# EAGLE schematic Light Table Board (EAGLE 7.1.0)
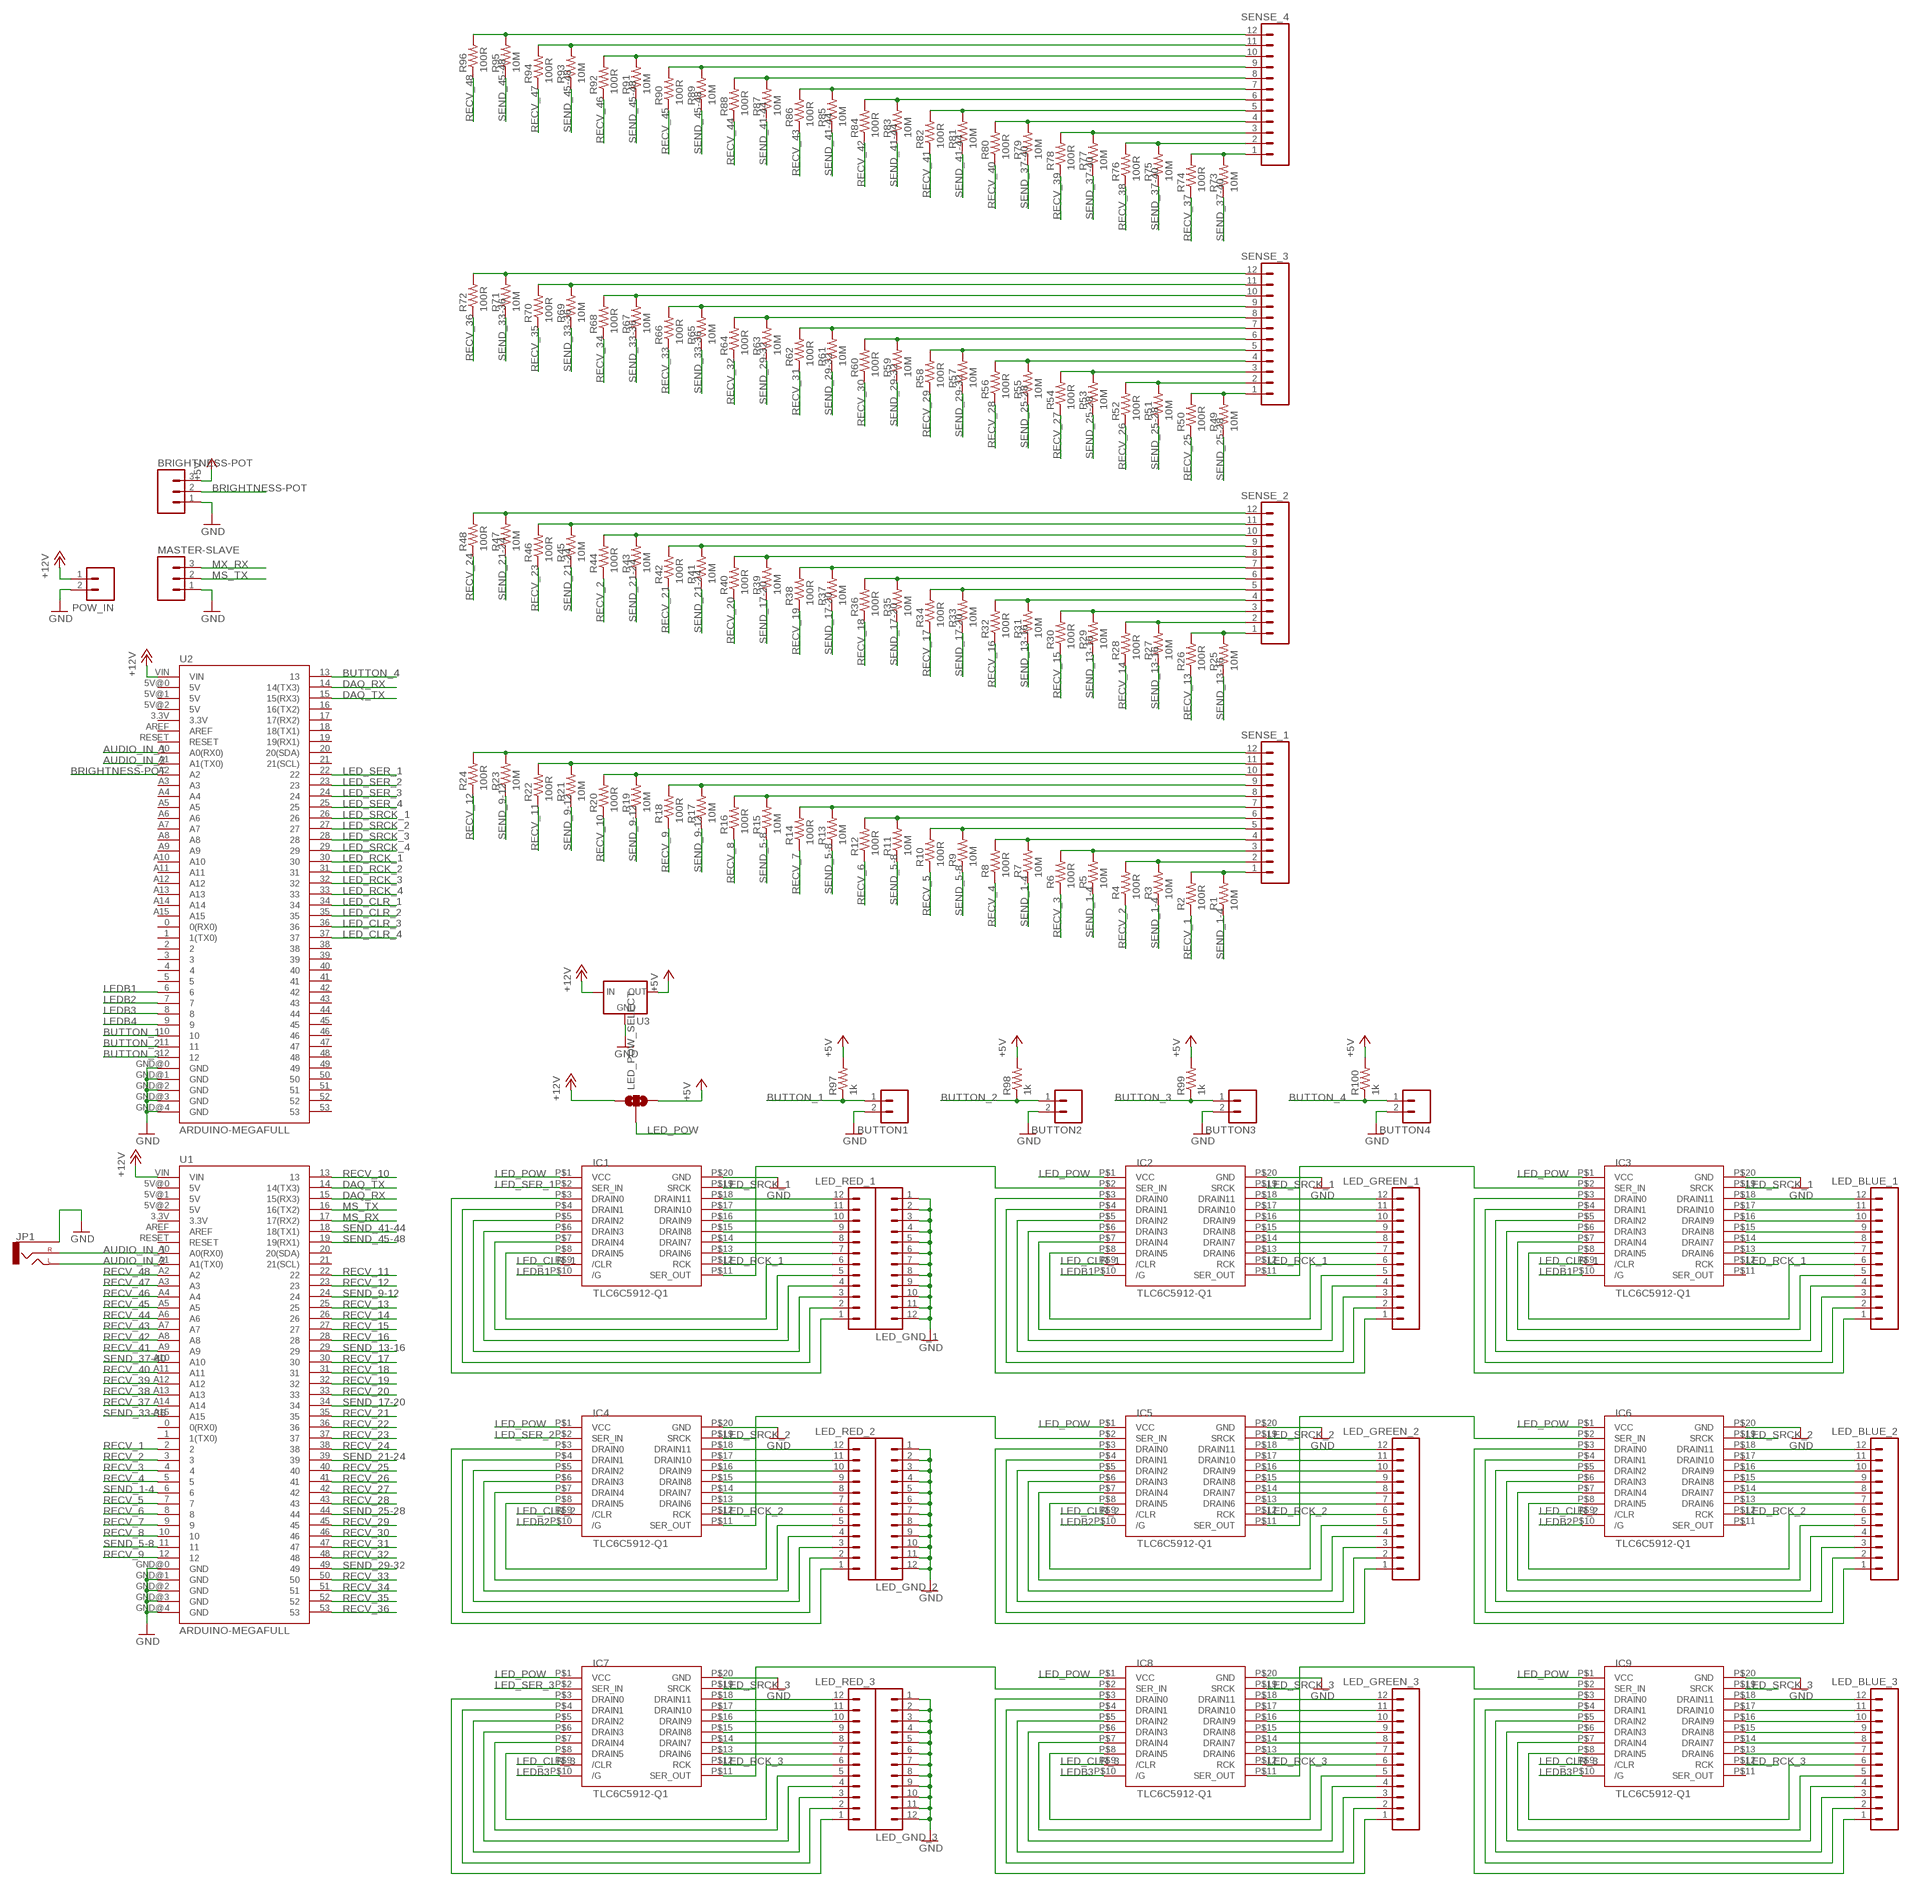
[diagram p0: schematic, sheet 1, part 1 of 2]
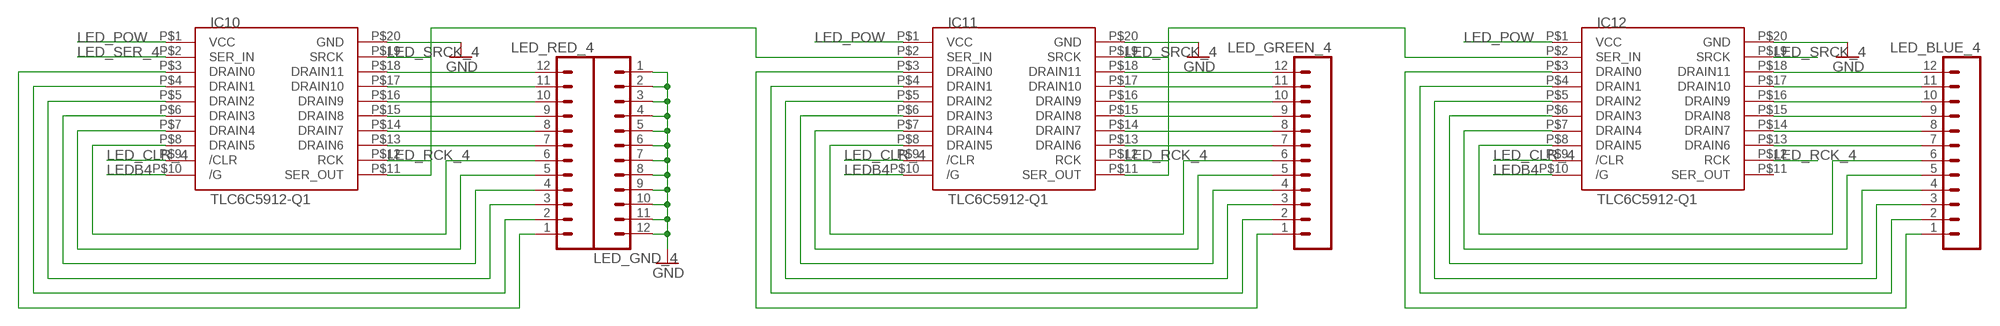
[diagram p1: schematic, sheet 1, part 2 of 2]

## Parts
BRIGHTNESS-POT  M03SCREW  [SCREWTERMINAL-3.5MM-3]
BUTTON1  M023.5MM-NO_SILK  [SCREWTERMINAL-3.5MM-2-NS]
BUTTON2  M023.5MM-NO_SILK  [SCREWTERMINAL-3.5MM-2-NS]
BUTTON3  M023.5MM-NO_SILK  [SCREWTERMINAL-3.5MM-2-NS]
BUTTON4  M023.5MM-NO_SILK  [SCREWTERMINAL-3.5MM-2-NS]
IC1  TLC6C5912-Q1  [SOIC-20]
IC2  TLC6C5912-Q1  [SOIC-20]
IC3  TLC6C5912-Q1  [SOIC-20]
IC4  TLC6C5912-Q1  [SOIC-20]
IC5  TLC6C5912-Q1  [SOIC-20]
IC6  TLC6C5912-Q1  [SOIC-20]
IC7  TLC6C5912-Q1  [SOIC-20]
IC8  TLC6C5912-Q1  [SOIC-20]
IC9  TLC6C5912-Q1  [SOIC-20]
IC10  TLC6C5912-Q1  [SOIC-20]
IC11  TLC6C5912-Q1  [SOIC-20]
IC12  TLC6C5912-Q1  [SOIC-20]
JP1  AUDIO-JACK2.5MM  [STEREOJACK2.5MM_STEREOJACK2.5MM]
LED_BLUE_1  M12LONGPADS  [1X12_LONGPADS]
LED_BLUE_2  M12LONGPADS  [1X12_LONGPADS]
LED_BLUE_3  M12LONGPADS  [1X12_LONGPADS]
LED_BLUE_4  M12LONGPADS  [1X12_LONGPADS]
LED_GND_1  M12LONGPADS  [1X12_LONGPADS]
LED_GND_2  M12LONGPADS  [1X12_LONGPADS]
LED_GND_3  M12LONGPADS  [1X12_LONGPADS]
LED_GND_4  M12LONGPADS  [1X12_LONGPADS]
LED_GREEN_1  M12LONGPADS  [1X12_LONGPADS]
LED_GREEN_2  M12LONGPADS  [1X12_LONGPADS]
LED_GREEN_3  M12LONGPADS  [1X12_LONGPADS]
LED_GREEN_4  M12LONGPADS  [1X12_LONGPADS]
LED_POW_SELECT  SOLDERJUMPER_2WAYS  [SJ_3]
LED_RED_1  M12LONGPADS  [1X12_LONGPADS]
LED_RED_2  M12LONGPADS  [1X12_LONGPADS]
LED_RED_3  M12LONGPADS  [1X12_LONGPADS]
LED_RED_4  M12LONGPADS  [1X12_LONGPADS]
MASTER-SLAVE  M03SCREW  [SCREWTERMINAL-3.5MM-3]
POW_IN  M023.5MM-NO_SILK  [SCREWTERMINAL-3.5MM-2-NS]
R1  10M  R-US_R1206  [R1206]
R2  100R  R-US_R1206  [R1206]
R3  10M  R-US_R1206  [R1206]
R4  100R  R-US_R1206  [R1206]
R5  10M  R-US_R1206  [R1206]
R6  100R  R-US_R1206  [R1206]
R7  10M  R-US_R1206  [R1206]
R8  100R  R-US_R1206  [R1206]
R9  10M  R-US_R1206  [R1206]
R10  100R  R-US_R1206  [R1206]
R11  10M  R-US_R1206  [R1206]
R12  100R  R-US_R1206  [R1206]
R13  10M  R-US_R1206  [R1206]
R14  100R  R-US_R1206  [R1206]
R15  10M  R-US_R1206  [R1206]
R16  100R  R-US_R1206  [R1206]
R17  10M  R-US_R1206  [R1206]
R18  100R  R-US_R1206  [R1206]
R19  10M  R-US_R1206  [R1206]
R20  100R  R-US_R1206  [R1206]
R21  10M  R-US_R1206  [R1206]
R22  100R  R-US_R1206  [R1206]
R23  10M  R-US_R1206  [R1206]
R24  100R  R-US_R1206  [R1206]
R25  10M  R-US_R1206  [R1206]
R26  100R  R-US_R1206  [R1206]
R27  10M  R-US_R1206  [R1206]
R28  100R  R-US_R1206  [R1206]
R29  10M  R-US_R1206  [R1206]
R30  100R  R-US_R1206  [R1206]
R31  10M  R-US_R1206  [R1206]
R32  100R  R-US_R1206  [R1206]
R33  10M  R-US_R1206  [R1206]
R34  100R  R-US_R1206  [R1206]
R35  10M  R-US_R1206  [R1206]
R36  100R  R-US_R1206  [R1206]
R37  10M  R-US_R1206  [R1206]
R38  100R  R-US_R1206  [R1206]
R39  10M  R-US_R1206  [R1206]
R40  100R  R-US_R1206  [R1206]
R41  10M  R-US_R1206  [R1206]
R42  100R  R-US_R1206  [R1206]
R43  10M  R-US_R1206  [R1206]
R44  100R  R-US_R1206  [R1206]
R45  10M  R-US_R1206  [R1206]
R46  100R  R-US_R1206  [R1206]
R47  10M  R-US_R1206  [R1206]
R48  100R  R-US_R1206  [R1206]
R49  10M  R-US_R1206  [R1206]
R50  100R  R-US_R1206  [R1206]
R51  10M  R-US_R1206  [R1206]
R52  100R  R-US_R1206  [R1206]
R53  10M  R-US_R1206  [R1206]
R54  100R  R-US_R1206  [R1206]
R55  10M  R-US_R1206  [R1206]
R56  100R  R-US_R1206  [R1206]
R57  10M  R-US_R1206  [R1206]
R58  100R  R-US_R1206  [R1206]
R59  10M  R-US_R1206  [R1206]
R60  100R  R-US_R1206  [R1206]
R61  10M  R-US_R1206  [R1206]
R62  100R  R-US_R1206  [R1206]
R63  10M  R-US_R1206  [R1206]
R64  100R  R-US_R1206  [R1206]
R65  10M  R-US_R1206  [R1206]
R66  100R  R-US_R1206  [R1206]
R67  10M  R-US_R1206  [R1206]
R68  100R  R-US_R1206  [R1206]
R69  10M  R-US_R1206  [R1206]
R70  100R  R-US_R1206  [R1206]
R71  10M  R-US_R1206  [R1206]
R72  100R  R-US_R1206  [R1206]
R73  10M  R-US_R1206  [R1206]
R74  100R  R-US_R1206  [R1206]
R75  10M  R-US_R1206  [R1206]
R76  100R  R-US_R1206  [R1206]
R77  10M  R-US_R1206  [R1206]
R78  100R  R-US_R1206  [R1206]
R79  10M  R-US_R1206  [R1206]
R80  100R  R-US_R1206  [R1206]
R81  10M  R-US_R1206  [R1206]
R82  100R  R-US_R1206  [R1206]
R83  10M  R-US_R1206  [R1206]
R84  100R  R-US_R1206  [R1206]
R85  10M  R-US_R1206  [R1206]
R86  100R  R-US_R1206  [R1206]
R87  10M  R-US_R1206  [R1206]
R88  100R  R-US_R1206  [R1206]
R89  10M  R-US_R1206  [R1206]
R90  100R  R-US_R1206  [R1206]
R91  10M  R-US_R1206  [R1206]
R92  100R  R-US_R1206  [R1206]
R93  10M  R-US_R1206  [R1206]
R94  100R  R-US_R1206  [R1206]
R95  10M  R-US_R1206  [R1206]
R96  100R  R-US_R1206  [R1206]
R97  1k  R-US_R1206  [R1206]
R98  1k  R-US_R1206  [R1206]
R99  1k  R-US_R1206  [R1206]
R100  1k  R-US_R1206  [R1206]
SENSE_1  M12LONGPADS  [1X12_LONGPADS]
SENSE_2  M12LONGPADS  [1X12_LONGPADS]
SENSE_3  M12LONGPADS  [1X12_LONGPADS]
SENSE_4  M12LONGPADS  [1X12_LONGPADS]
U1  ARDUINO-MEGAFULL  [ARDUINO_MEGA]
U2  ARDUINO-MEGAFULL  [ARDUINO_MEGA]
U3  V_REG_78XX-TO-220  [TO-220-ALT]

## Nets
+5V: BRIGHTNESS-POT.3 LED_POW_SELECT.3 R97.2 R98.2 R99.2 R100.2 U3.OUT
+12V: LED_POW_SELECT.1 POW_IN.1 U1.VIN U2.VIN U3.IN
AUDIO_IN_1: JP1.TIP(RIGHT) U1.A0(A0(RX0)) U2.A0(A0(RX0))
AUDIO_IN_2: JP1.SHIELD(LEFT) U1.A1(A1(TX0)) U2.A1(A1(TX0))
BRIGHTNESS-POT: BRIGHTNESS-POT.2 U2.A2
BUTTON_1: BUTTON1.1 R97.1 U2.10
BUTTON_2: BUTTON2.1 R98.1 U2.11
BUTTON_3: BUTTON3.1 R99.1 U2.12
BUTTON_4: BUTTON4.1 R100.1 U2.13
DAQ_RX: U1.15(15(RX3)) U2.14(14(TX3))
DAQ_TX: U1.14(14(TX3)) U2.15(15(RX3))
GND: BRIGHTNESS-POT.1 BUTTON1.2 BUTTON2.2 BUTTON3.2 BUTTON4.2 IC1.P$20(GND) IC2.P$20(GND) IC3.P$20(GND) IC4.P$20(GND) IC5.P$20(GND) IC6.P$20(GND) IC7.P$20(GND) IC8.P$20(GND) IC9.P$20(GND) IC10.P$20(GND) IC11.P$20(GND) IC12.P$20(GND) JP1.RING1(SLEEVE) LED_GND_1.1 LED_GND_1.2 LED_GND_1.3 LED_GND_1.4 LED_GND_1.5 LED_GND_1.6 LED_GND_1.7 LED_GND_1.8 LED_GND_1.9 LED_GND_1.10 LED_GND_1.11 LED_GND_1.12 LED_GND_2.1 LED_GND_2.2 LED_GND_2.3 LED_GND_2.4 LED_GND_2.5 LED_GND_2.6 LED_GND_2.7 LED_GND_2.8 LED_GND_2.9 LED_GND_2.10 LED_GND_2.11 LED_GND_2.12 LED_GND_3.1 LED_GND_3.2 LED_GND_3.3 LED_GND_3.4 LED_GND_3.5 LED_GND_3.6 LED_GND_3.7 LED_GND_3.8 LED_GND_3.9 LED_GND_3.10 LED_GND_3.11 LED_GND_3.12 LED_GND_4.1 LED_GND_4.2 LED_GND_4.3 LED_GND_4.4 LED_GND_4.5 LED_GND_4.6 LED_GND_4.7 LED_GND_4.8 LED_GND_4.9 LED_GND_4.10 LED_GND_4.11 LED_GND_4.12 MASTER-SLAVE.1 POW_IN.2 U1.GND@0(GND) U1.GND@1(GND) U1.GND@2(GND) U1.GND@3(GND) U1.GND@4(GND) U2.GND@0(GND) U2.GND@1(GND) U2.GND@2(GND) U2.GND@3(GND) U2.GND@4(GND) U3.GND
LED_CLR_1: IC1.P$9(/CLR) IC2.P$9(/CLR) IC3.P$9(/CLR) U2.34
LED_CLR_2: IC4.P$9(/CLR) IC5.P$9(/CLR) IC6.P$9(/CLR) U2.35
LED_CLR_3: IC7.P$9(/CLR) IC8.P$9(/CLR) IC9.P$9(/CLR) U2.36
LED_CLR_4: IC10.P$9(/CLR) IC11.P$9(/CLR) IC12.P$9(/CLR) U2.37
LED_POW: IC1.P$1(VCC) IC2.P$1(VCC) IC3.P$1(VCC) IC4.P$1(VCC) IC5.P$1(VCC) IC6.P$1(VCC) IC7.P$1(VCC) IC8.P$1(VCC) IC9.P$1(VCC) IC10.P$1(VCC) IC11.P$1(VCC) IC12.P$1(VCC) LED_POW_SELECT.2
LED_RCK_1: IC1.P$12(RCK) IC2.P$12(RCK) IC3.P$12(RCK) U2.30
LED_RCK_2: IC4.P$12(RCK) IC5.P$12(RCK) IC6.P$12(RCK) U2.31
LED_RCK_3: IC7.P$12(RCK) IC8.P$12(RCK) IC9.P$12(RCK) U2.32
LED_RCK_4: IC10.P$12(RCK) IC11.P$12(RCK) IC12.P$12(RCK) U2.33
LED_SER_1: IC1.P$2(SER_IN) U2.22
LED_SER_2: IC4.P$2(SER_IN) U2.23
LED_SER_3: IC7.P$2(SER_IN) U2.24
LED_SER_4: IC10.P$2(SER_IN) U2.25
LED_SRCK_1: IC1.P$19(SRCK) IC2.P$19(SRCK) IC3.P$19(SRCK) U2.26
LED_SRCK_2: IC4.P$19(SRCK) IC5.P$19(SRCK) IC6.P$19(SRCK) U2.27
LED_SRCK_3: IC7.P$19(SRCK) IC8.P$19(SRCK) IC9.P$19(SRCK) U2.28
LED_SRCK_4: IC10.P$19(SRCK) IC11.P$19(SRCK) IC12.P$19(SRCK) U2.29
LEDB1: IC1.P$10(/G) IC2.P$10(/G) IC3.P$10(/G) U2.6
LEDB2: IC4.P$10(/G) IC5.P$10(/G) IC6.P$10(/G) U2.7
LEDB3: IC7.P$10(/G) IC8.P$10(/G) IC9.P$10(/G) U2.8
LEDB4: IC10.P$10(/G) IC11.P$10(/G) IC12.P$10(/G) U2.9
MS_RX: U1.17(17(RX2))
MS_TX: MASTER-SLAVE.2 U1.16(16(TX2))
MX_RX: MASTER-SLAVE.3
N$1: IC1.P$8(DRAIN5) LED_RED_1.6
N$2: IC1.P$18(DRAIN11) LED_RED_1.12
N$3: IC1.P$17(DRAIN10) LED_RED_1.11
N$4: IC1.P$16(DRAIN9) LED_RED_1.10
N$5: IC1.P$15(DRAIN8) LED_RED_1.9
N$6: IC1.P$14(DRAIN7) LED_RED_1.8
N$7: IC1.P$13(DRAIN6) LED_RED_1.7
N$8: IC1.P$7(DRAIN4) LED_RED_1.5
N$9: IC1.P$6(DRAIN3) LED_RED_1.4
N$10: IC1.P$5(DRAIN2) LED_RED_1.3
N$11: IC1.P$4(DRAIN1) LED_RED_1.2
N$12: IC1.P$3(DRAIN0) LED_RED_1.1
N$13: IC2.P$8(DRAIN5) LED_GREEN_1.6
N$14: IC2.P$18(DRAIN11) LED_GREEN_1.12
N$15: IC2.P$17(DRAIN10) LED_GREEN_1.11
N$16: IC2.P$16(DRAIN9) LED_GREEN_1.10
N$17: IC2.P$15(DRAIN8) LED_GREEN_1.9
N$18: IC2.P$14(DRAIN7) LED_GREEN_1.8
N$19: IC2.P$13(DRAIN6) LED_GREEN_1.7
N$20: IC2.P$7(DRAIN4) LED_GREEN_1.5
N$21: IC2.P$6(DRAIN3) LED_GREEN_1.4
N$22: IC2.P$5(DRAIN2) LED_GREEN_1.3
N$23: IC2.P$4(DRAIN1) LED_GREEN_1.2
N$24: IC2.P$3(DRAIN0) LED_GREEN_1.1
N$25: IC1.P$11(SER_OUT) IC2.P$2(SER_IN)
N$26: IC3.P$8(DRAIN5) LED_BLUE_1.6
N$27: IC3.P$18(DRAIN11) LED_BLUE_1.12
N$28: IC3.P$17(DRAIN10) LED_BLUE_1.11
N$29: IC3.P$16(DRAIN9) LED_BLUE_1.10
N$30: IC3.P$15(DRAIN8) LED_BLUE_1.9
N$31: IC3.P$14(DRAIN7) LED_BLUE_1.8
N$32: IC3.P$13(DRAIN6) LED_BLUE_1.7
N$33: IC3.P$7(DRAIN4) LED_BLUE_1.5
N$34: IC3.P$6(DRAIN3) LED_BLUE_1.4
N$35: IC3.P$5(DRAIN2) LED_BLUE_1.3
N$36: IC3.P$4(DRAIN1) LED_BLUE_1.2
N$37: IC3.P$3(DRAIN0) LED_BLUE_1.1
N$38: IC2.P$11(SER_OUT) IC3.P$2(SER_IN)
N$39: R1.2 R2.2 SENSE_1.1
N$40: IC4.P$8(DRAIN5) LED_RED_2.6
N$41: IC4.P$18(DRAIN11) LED_RED_2.12
N$42: IC4.P$17(DRAIN10) LED_RED_2.11
N$43: IC4.P$16(DRAIN9) LED_RED_2.10
N$44: IC4.P$15(DRAIN8) LED_RED_2.9
N$45: IC4.P$14(DRAIN7) LED_RED_2.8
N$46: IC4.P$13(DRAIN6) LED_RED_2.7
N$47: IC4.P$7(DRAIN4) LED_RED_2.5
N$48: IC4.P$6(DRAIN3) LED_RED_2.4
N$49: IC4.P$5(DRAIN2) LED_RED_2.3
N$50: IC4.P$4(DRAIN1) LED_RED_2.2
N$51: IC4.P$3(DRAIN0) LED_RED_2.1
N$52: IC5.P$8(DRAIN5) LED_GREEN_2.6
N$53: IC5.P$18(DRAIN11) LED_GREEN_2.12
N$54: IC5.P$17(DRAIN10) LED_GREEN_2.11
N$55: IC5.P$16(DRAIN9) LED_GREEN_2.10
N$56: IC5.P$15(DRAIN8) LED_GREEN_2.9
N$57: IC5.P$14(DRAIN7) LED_GREEN_2.8
N$58: IC5.P$13(DRAIN6) LED_GREEN_2.7
N$59: IC5.P$7(DRAIN4) LED_GREEN_2.5
N$60: IC5.P$6(DRAIN3) LED_GREEN_2.4
N$61: IC5.P$5(DRAIN2) LED_GREEN_2.3
N$62: IC5.P$4(DRAIN1) LED_GREEN_2.2
N$63: IC5.P$3(DRAIN0) LED_GREEN_2.1
N$64: IC4.P$11(SER_OUT) IC5.P$2(SER_IN)
N$65: IC6.P$8(DRAIN5) LED_BLUE_2.6
N$66: IC6.P$18(DRAIN11) LED_BLUE_2.12
N$67: IC6.P$17(DRAIN10) LED_BLUE_2.11
N$68: IC6.P$16(DRAIN9) LED_BLUE_2.10
N$69: IC6.P$15(DRAIN8) LED_BLUE_2.9
N$70: IC6.P$14(DRAIN7) LED_BLUE_2.8
N$71: IC6.P$13(DRAIN6) LED_BLUE_2.7
N$72: IC6.P$7(DRAIN4) LED_BLUE_2.5
N$73: IC6.P$6(DRAIN3) LED_BLUE_2.4
N$74: IC6.P$5(DRAIN2) LED_BLUE_2.3
N$75: IC6.P$4(DRAIN1) LED_BLUE_2.2
N$76: IC6.P$3(DRAIN0) LED_BLUE_2.1
N$77: IC5.P$11(SER_OUT) IC6.P$2(SER_IN)
N$78: IC7.P$8(DRAIN5) LED_RED_3.6
N$79: IC7.P$18(DRAIN11) LED_RED_3.12
N$80: IC7.P$17(DRAIN10) LED_RED_3.11
N$81: IC7.P$16(DRAIN9) LED_RED_3.10
N$82: IC7.P$15(DRAIN8) LED_RED_3.9
N$83: IC7.P$14(DRAIN7) LED_RED_3.8
N$84: IC7.P$13(DRAIN6) LED_RED_3.7
N$85: IC7.P$7(DRAIN4) LED_RED_3.5
N$86: IC7.P$6(DRAIN3) LED_RED_3.4
N$87: IC7.P$5(DRAIN2) LED_RED_3.3
N$88: IC7.P$4(DRAIN1) LED_RED_3.2
N$89: IC7.P$3(DRAIN0) LED_RED_3.1
N$90: IC8.P$8(DRAIN5) LED_GREEN_3.6
N$91: IC8.P$18(DRAIN11) LED_GREEN_3.12
N$92: IC8.P$17(DRAIN10) LED_GREEN_3.11
N$93: IC8.P$16(DRAIN9) LED_GREEN_3.10
N$94: IC8.P$15(DRAIN8) LED_GREEN_3.9
N$95: IC8.P$14(DRAIN7) LED_GREEN_3.8
N$96: IC8.P$13(DRAIN6) LED_GREEN_3.7
N$97: IC8.P$7(DRAIN4) LED_GREEN_3.5
N$98: IC8.P$6(DRAIN3) LED_GREEN_3.4
N$99: IC8.P$5(DRAIN2) LED_GREEN_3.3
N$100: IC8.P$4(DRAIN1) LED_GREEN_3.2
N$101: IC8.P$3(DRAIN0) LED_GREEN_3.1
N$102: IC7.P$11(SER_OUT) IC8.P$2(SER_IN)
N$103: IC9.P$8(DRAIN5) LED_BLUE_3.6
N$104: IC9.P$18(DRAIN11) LED_BLUE_3.12
N$105: IC9.P$17(DRAIN10) LED_BLUE_3.11
N$106: IC9.P$16(DRAIN9) LED_BLUE_3.10
N$107: IC9.P$15(DRAIN8) LED_BLUE_3.9
N$108: IC9.P$14(DRAIN7) LED_BLUE_3.8
N$109: IC9.P$13(DRAIN6) LED_BLUE_3.7
N$110: IC9.P$7(DRAIN4) LED_BLUE_3.5
N$111: IC9.P$6(DRAIN3) LED_BLUE_3.4
N$112: IC9.P$5(DRAIN2) LED_BLUE_3.3
N$113: IC9.P$4(DRAIN1) LED_BLUE_3.2
N$114: IC9.P$3(DRAIN0) LED_BLUE_3.1
N$115: IC8.P$11(SER_OUT) IC9.P$2(SER_IN)
N$116: IC10.P$8(DRAIN5) LED_RED_4.6
N$117: IC10.P$18(DRAIN11) LED_RED_4.12
N$118: IC10.P$17(DRAIN10) LED_RED_4.11
N$119: IC10.P$16(DRAIN9) LED_RED_4.10
N$120: IC10.P$15(DRAIN8) LED_RED_4.9
N$121: IC10.P$14(DRAIN7) LED_RED_4.8
N$122: IC10.P$13(DRAIN6) LED_RED_4.7
N$123: IC10.P$7(DRAIN4) LED_RED_4.5
N$124: IC10.P$6(DRAIN3) LED_RED_4.4
N$125: IC10.P$5(DRAIN2) LED_RED_4.3
N$126: IC10.P$4(DRAIN1) LED_RED_4.2
N$127: IC10.P$3(DRAIN0) LED_RED_4.1
N$128: IC11.P$8(DRAIN5) LED_GREEN_4.6
N$129: IC11.P$18(DRAIN11) LED_GREEN_4.12
N$130: IC11.P$17(DRAIN10) LED_GREEN_4.11
N$131: IC11.P$16(DRAIN9) LED_GREEN_4.10
N$132: IC11.P$15(DRAIN8) LED_GREEN_4.9
N$133: IC11.P$14(DRAIN7) LED_GREEN_4.8
N$134: IC11.P$13(DRAIN6) LED_GREEN_4.7
N$135: IC11.P$7(DRAIN4) LED_GREEN_4.5
N$136: IC11.P$6(DRAIN3) LED_GREEN_4.4
N$137: IC11.P$5(DRAIN2) LED_GREEN_4.3
N$138: IC11.P$4(DRAIN1) LED_GREEN_4.2
N$139: IC11.P$3(DRAIN0) LED_GREEN_4.1
N$140: IC10.P$11(SER_OUT) IC11.P$2(SER_IN)
N$141: IC12.P$8(DRAIN5) LED_BLUE_4.6
N$142: IC12.P$18(DRAIN11) LED_BLUE_4.12
N$143: IC12.P$17(DRAIN10) LED_BLUE_4.11
N$144: IC12.P$16(DRAIN9) LED_BLUE_4.10
N$145: IC12.P$15(DRAIN8) LED_BLUE_4.9
N$146: IC12.P$14(DRAIN7) LED_BLUE_4.8
N$147: IC12.P$13(DRAIN6) LED_BLUE_4.7
N$148: IC12.P$7(DRAIN4) LED_BLUE_4.5
N$149: IC12.P$6(DRAIN3) LED_BLUE_4.4
N$150: IC12.P$5(DRAIN2) LED_BLUE_4.3
N$151: IC12.P$4(DRAIN1) LED_BLUE_4.2
N$152: IC12.P$3(DRAIN0) LED_BLUE_4.1
N$153: IC11.P$11(SER_OUT) IC12.P$2(SER_IN)
N$154: R3.2 R4.2 SENSE_1.2
N$155: R5.2 R6.2 SENSE_1.3
N$156: R7.2 R8.2 SENSE_1.4
N$157: R9.2 R10.2 SENSE_1.5
N$158: R11.2 R12.2 SENSE_1.6
N$159: R13.2 R14.2 SENSE_1.7
N$160: R15.2 R16.2 SENSE_1.8
N$161: R17.2 R18.2 SENSE_1.9
N$162: R19.2 R20.2 SENSE_1.10
N$163: R21.2 R22.2 SENSE_1.11
N$164: R23.2 R24.2 SENSE_1.12
N$165: R25.2 R26.2 SENSE_2.1
N$166: R27.2 R28.2 SENSE_2.2
N$167: R29.2 R30.2 SENSE_2.3
N$168: R31.2 R32.2 SENSE_2.4
N$169: R33.2 R34.2 SENSE_2.5
N$170: R35.2 R36.2 SENSE_2.6
N$171: R37.2 R38.2 SENSE_2.7
N$172: R39.2 R40.2 SENSE_2.8
N$173: R41.2 R42.2 SENSE_2.9
N$174: R43.2 R44.2 SENSE_2.10
N$175: R45.2 R46.2 SENSE_2.11
N$176: R47.2 R48.2 SENSE_2.12
N$177: R49.2 R50.2 SENSE_3.1
N$178: R51.2 R52.2 SENSE_3.2
N$179: R53.2 R54.2 SENSE_3.3
N$180: R55.2 R56.2 SENSE_3.4
N$181: R57.2 R58.2 SENSE_3.5
N$182: R59.2 R60.2 SENSE_3.6
N$183: R61.2 R62.2 SENSE_3.7
N$184: R63.2 R64.2 SENSE_3.8
N$185: R65.2 R66.2 SENSE_3.9
N$186: R67.2 R68.2 SENSE_3.10
N$187: R69.2 R70.2 SENSE_3.11
N$188: R71.2 R72.2 SENSE_3.12
N$189: R73.2 R74.2 SENSE_4.1
N$190: R75.2 R76.2 SENSE_4.2
N$191: R77.2 R78.2 SENSE_4.3
N$192: R79.2 R80.2 SENSE_4.4
N$193: R81.2 R82.2 SENSE_4.5
N$194: R83.2 R84.2 SENSE_4.6
N$195: R85.2 R86.2 SENSE_4.7
N$196: R87.2 R88.2 SENSE_4.8
N$197: R89.2 R90.2 SENSE_4.9
N$198: R91.2 R92.2 SENSE_4.10
N$199: R93.2 R94.2 SENSE_4.11
N$200: R95.2 R96.2 SENSE_4.12
RECV_1: R2.1 U1.2
RECV_2: R4.1 R44.1 U1.3
RECV_3: R6.1 U1.4
RECV_4: R8.1 U1.5
RECV_5: R10.1 U1.7
RECV_6: R12.1 U1.8
RECV_7: R14.1 U1.9
RECV_8: R16.1 U1.10
RECV_9: R18.1 U1.12
RECV_10: R20.1 U1.13
RECV_11: R22.1 U1.22
RECV_12: R24.1 U1.23
RECV_13: R26.1 U1.25
RECV_14: R28.1 U1.26
RECV_15: R30.1 U1.27
RECV_16: R32.1 U1.28
RECV_17: R34.1 U1.30
RECV_18: R36.1 U1.31
RECV_19: R38.1 U1.32
RECV_20: R40.1 U1.33
RECV_21: R42.1 U1.35
RECV_22: U1.36
RECV_23: R46.1 U1.37
RECV_24: R48.1 U1.38
RECV_25: R50.1 U1.40
RECV_26: R52.1 U1.41
RECV_27: R54.1 U1.42
RECV_28: R56.1 U1.43
RECV_29: R58.1 U1.45
RECV_30: R60.1 U1.46
RECV_31: R62.1 U1.47
RECV_32: R64.1 U1.48
RECV_33: R66.1 U1.50
RECV_34: R68.1 U1.51
RECV_35: R70.1 U1.52
RECV_36: R72.1 U1.53
RECV_37: R74.1 U1.A14
RECV_38: R76.1 U1.A13
RECV_39: R78.1 U1.A12
RECV_40: R80.1 U1.A11
RECV_41: R82.1 U1.A9
RECV_42: R84.1 U1.A8
RECV_43: R86.1 U1.A7
RECV_44: R88.1 U1.A6
RECV_45: R90.1 U1.A5
RECV_46: R92.1 U1.A4
RECV_47: R94.1 U1.A3
RECV_48: R96.1 U1.A2
SEND_1-4: R1.1 R3.1 R5.1 R7.1 U1.6
SEND_5-8: R9.1 R11.1 R13.1 R15.1 U1.11
SEND_9-12: R17.1 R19.1 R21.1 R23.1 U1.24
SEND_13-16: R25.1 R27.1 R29.1 R31.1 U1.29
SEND_17-20: R33.1 R35.1 R37.1 R39.1 U1.34
SEND_21-24: R41.1 R43.1 R45.1 R47.1 U1.39
SEND_25-28: R49.1 R51.1 R53.1 R55.1 U1.44
SEND_29-32: R57.1 R59.1 R61.1 R63.1 U1.49
SEND_33-36: R65.1 R67.1 R69.1 R71.1 U1.A15
SEND_37-40: R73.1 R75.1 R77.1 R79.1 U1.A10
SEND_41-44: R81.1 R83.1 R85.1 R87.1 U1.18(18(TX1))
SEND_45-48: R89.1 R91.1 R93.1 R95.1 U1.19(19(RX1))
Unconnected: IC3.P$11(SER_OUT) IC6.P$11(SER_OUT) IC9.P$11(SER_OUT) IC12.P$11(SER_OUT) U1.0(0(RX0)) U1.1(1(TX0)) U1.3.3V U1.5V@0(5V) U1.5V@1(5V) U1.5V@2(5V) U1.20(20(SDA)) U1.21(21(SCL)) U1.AREF U1.RESET U2.0(0(RX0)) U2.1(1(TX0)) U2.2 U2.3 U2.3.3V U2.4 U2.5 U2.5V@0(5V) U2.5V@1(5V) U2.5V@2(5V) U2.16(16(TX2)) U2.17(17(RX2)) U2.18(18(TX1)) U2.19(19(RX1)) U2.20(20(SDA)) U2.21(21(SCL)) U2.38 U2.39 U2.40 U2.41 U2.42 U2.43 U2.44 U2.45 U2.46 U2.47 U2.48 U2.49 U2.50 U2.51 U2.52 U2.53 U2.A3 U2.A4 U2.A5 U2.A6 U2.A7 U2.A8 U2.A9 U2.A10 U2.A11 U2.A12 U2.A13 U2.A14 U2.A15 U2.AREF U2.RESET

## Library data of the parts
BRIGHTNESS-POT MASTER-SLAVE = SparkFun-Connectors:M03: Header 3 Standard 3-pin 0.1" header. Use with straight break away headers (SKU : PRT-00116), right angle break away headers (PRT-00553), swiss pins (PRT-00743), machine pins (PRT-00117), and female headers (PRT-00115). Molex polarized connector foot print use with SKU : PRT-08232 with associated crimp pins and housings.; PROD_ID: CONN-08288
BUTTON1-BUTTON4 POW_IN = SparkFun-Connectors:M02: Standard 2-pin 0.1" header. Use with - straight break away headers ( PRT-00116) - right angle break away headers (PRT-00553) - swiss pins (PRT-00743) - machine pins (PRT-00117) - female headers (PRT-00115) Molex polarized connector foot print use with: PRT-08233 with associated crimp pins and housings. 2.54_SCREWTERM for use with PRT-10571. 3.5mm Screw Terminal footprints for PRT-08084 5mm Screw Terminal footprints for use with PRT-08432; PROD_ID: CONN-08399
IC1-IC12 = 2016PowerPackLibraries:TLC6C5912-Q1
JP1 = SparkFun-Connectors:AUDIO-JACK: 3.5mm Audio Jack Simple 3.5mm common PCB mount audio jack. Variant PTH is our storefront SKU PRT-08032
LED_BLUE_1-LED_BLUE_4 LED_GND_1-LED_GND_4 LED_GREEN_1-LED_GREEN_4 LED_RED_1-LED_RED_4 SENSE_1-SENSE_4 = SparkFun-Connectors:M12: Header 12 Standard 12-pin 0.1" header. Use with straight break away headers (SKU : PRT-00116), right angle break away headers (PRT-00553), swiss pins (PRT-00743), machine pins (PRT-00117), and female headers (PRT-00115).
LED_POW_SELECT = SparkFun-Retired:SOLDERJUMPER_2WAY: Solder Jumper 2 way solder jumper
R1-R100 = rcl:R-US_: RESISTOR, American symbol
U1 U2 = SparkFun-Boards:ARDUINO-MEGA: Arduino Mega board footprint
U3 = SparkFun-PowerIC:V_REG_78XX: Voltage Regulator Standard 78xx regulator. IGO (Input Ground Output). Spark Fun Electronics SKU : COM-00107; PROD_ID: VREG-08450; SF_ID: COM-00107